# EAGLE schematic world_clock_2.0 (EAGLE 9.3.2)
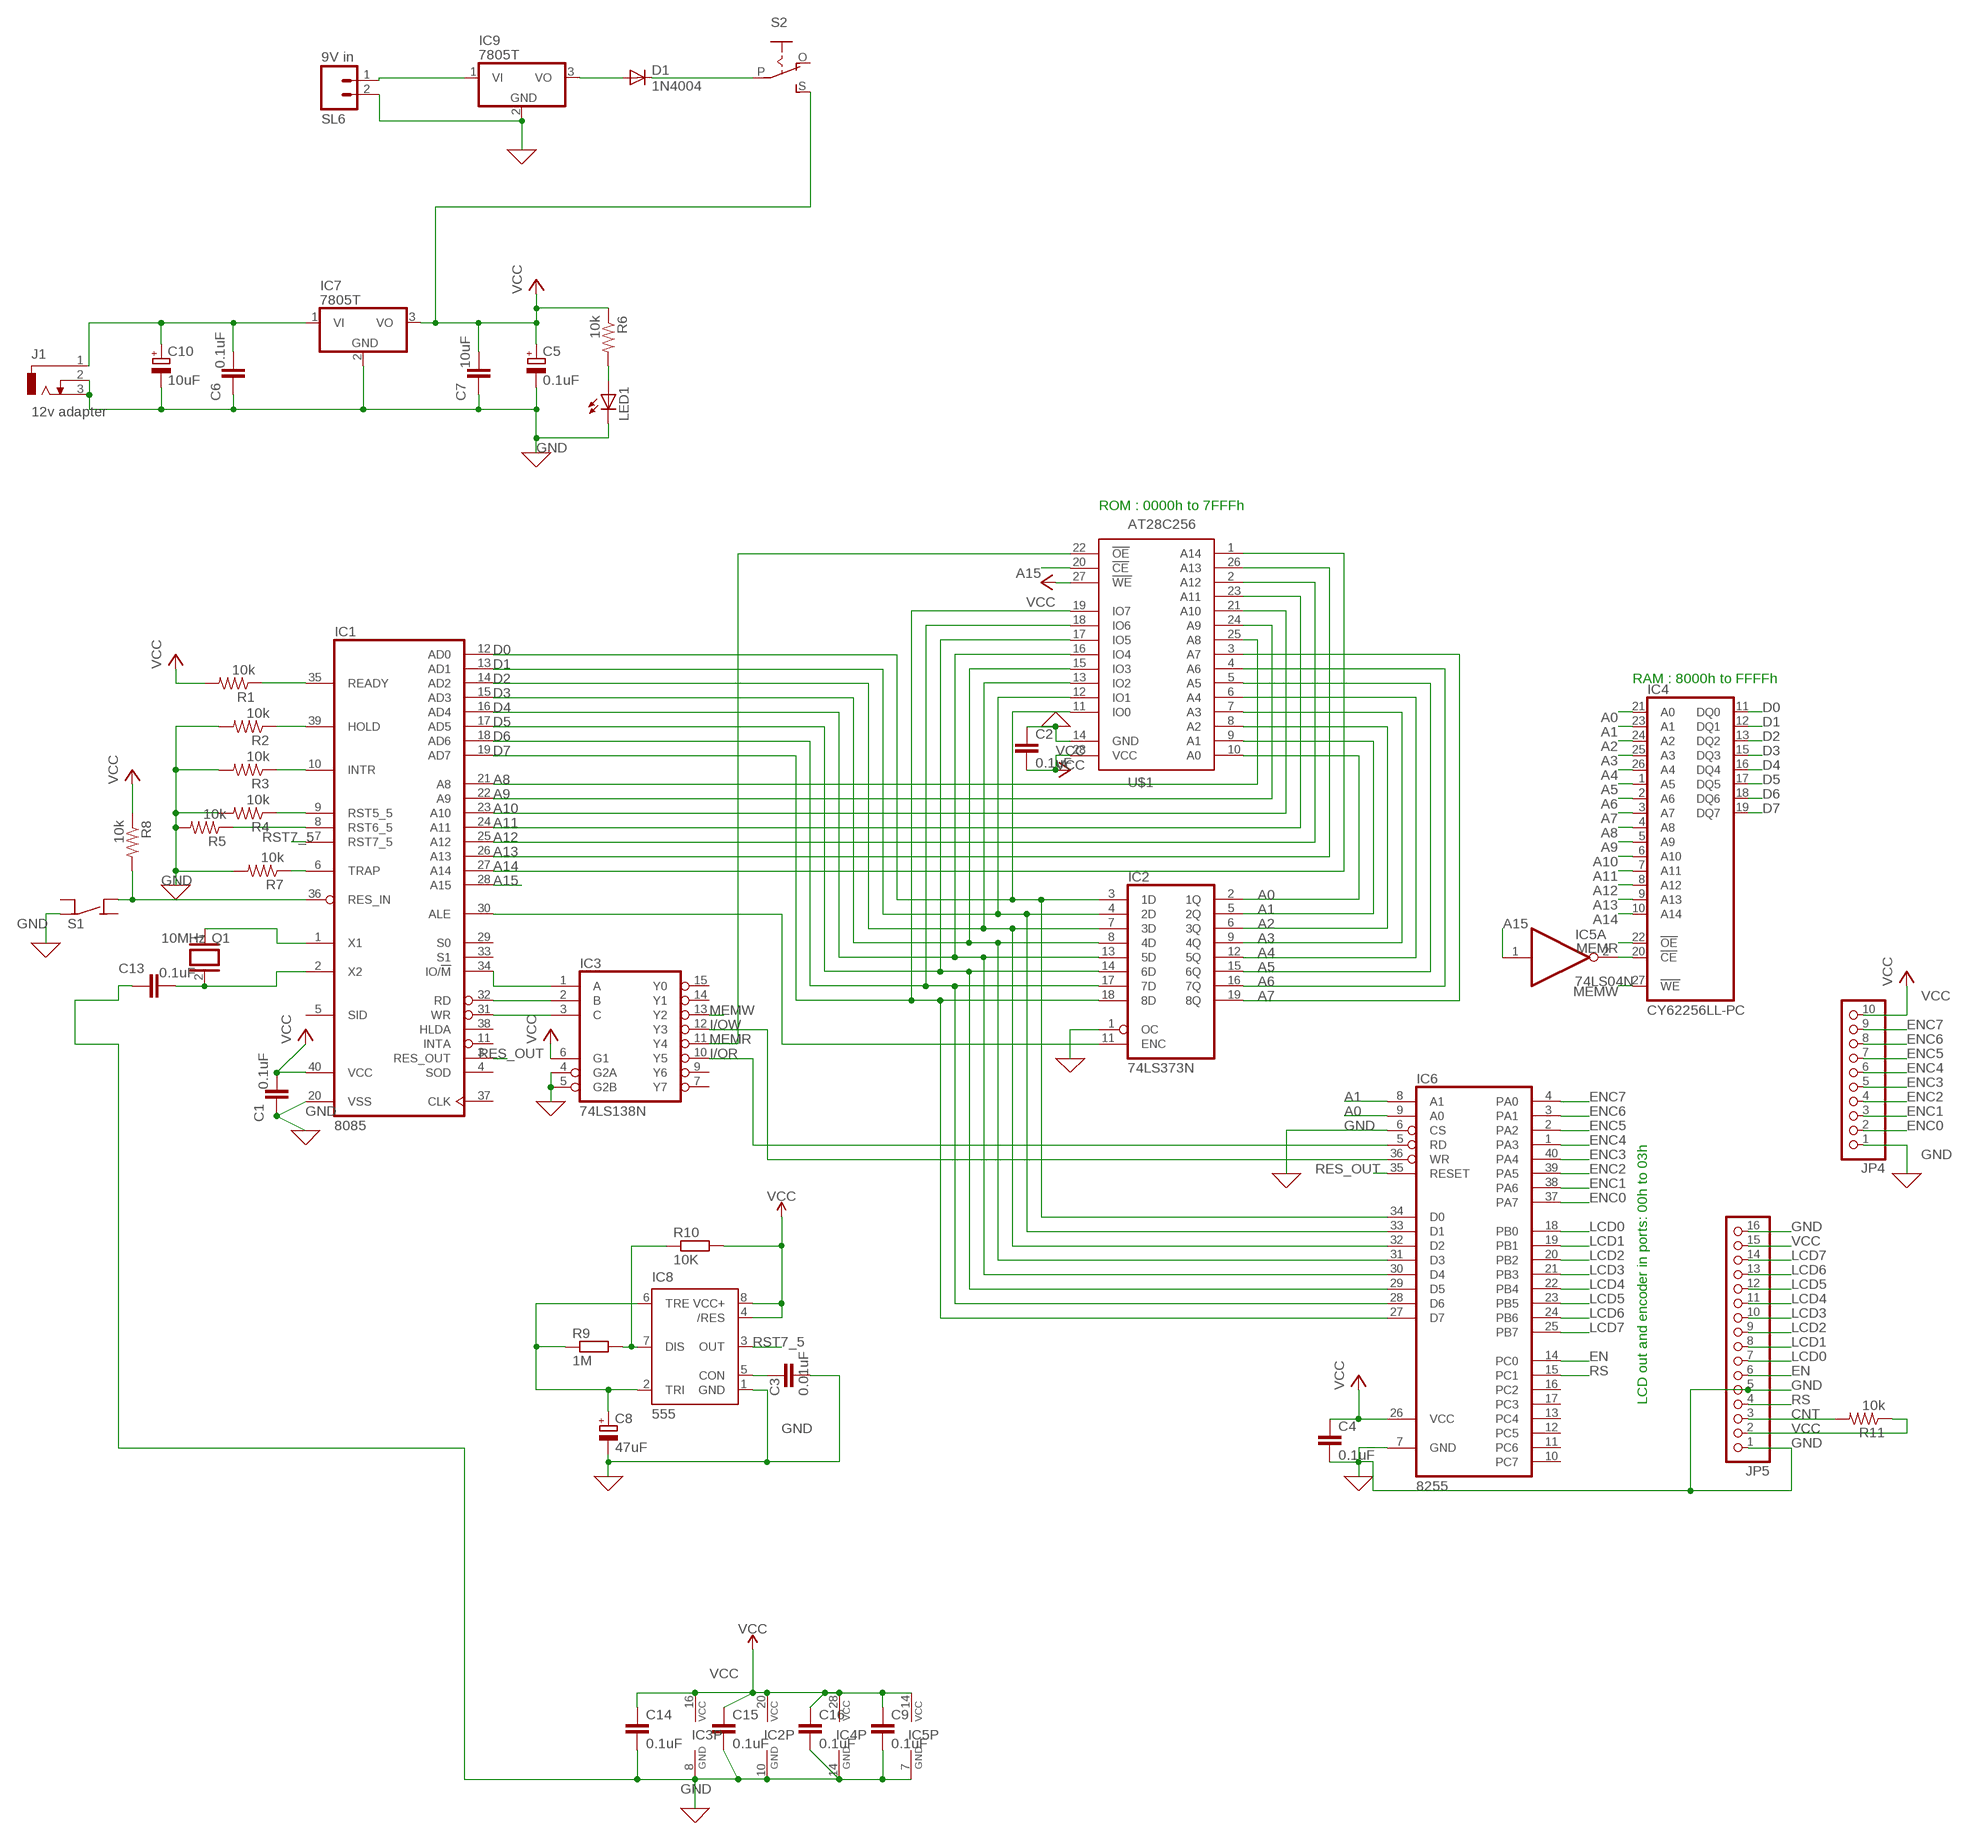
[diagram p0: schematic, sheet 1]

## Parts
C1  0.1uF  C-EU025-024X044  [C025-024X044]
C2  0.1uF  C-EU025-024X044  [C025-024X044]
C3  0.01uF  C2.5/2  [C2.5-2]
C4  0.1uF  C-EU025-024X044  [C025-024X044]
C5  0.1uF  CPOL-EUE5-8.5  [E5-8,5]
C6  0.1uF  C-EU025-024X044  [C025-024X044]
C7  10uF  C-EU025-024X044  [C025-024X044]
C8  47uF  CPOL-EUE5-8.5  [E5-8,5]
C9  0.1uF  C-EU025-024X044  [C025-024X044]
C10  10uF  CPOL-EUE5-8.5  [E5-8,5]
C13  0.1uF  C-EU025-024X044  [C025-024X044]
C14  0.1uF  C-EU025-024X044  [C025-024X044]
C15  0.1uF  C-EU025-024X044  [C025-024X044]
C16  0.1uF  C-EU025-024X044  [C025-024X044]
D1  1N4004  [DO41-10]
IC1  8085  [DIL40]
IC2  74LS373N  [DIL20]
IC3  74LS138N  [DIL16]
IC4  CY62256LL-PC  [DIL28-6]
IC5  74LS04N  [DIL14]
IC6  8255  82C55A  [DIL40]
IC7  7805T  [TO220H]
IC8  555  555KIT  [DIP08-KIT]
IC9  7805T  [TO220H]
J1  12v adapter  DCJ0303  [DCJ0303]
JP4  PINHD-1X10  [1X10]
JP5  PINHD-1X16  [1X16]
LED1  LED5MM  [LED5MM]
Q1  10MHz  XTAL/S  [QS]
R1  10k  R-US_0207/7  [0207/7]
R2  10k  R-US_0207/7  [0207/7]
R3  10k  R-US_0207/7  [0207/7]
R4  10k  R-US_0207/7  [0207/7]
R5  10k  R-US_0207/7  [0207/7]
R6  10k  R-US_0207/7  [0207/7]
R7  10k  R-US_0207/7  [0207/7]
R8  10k  R-US_0207/7  [0207/7]
R9  1M  R-EU_0204/5  [0204/5]
R10  10K  R-EU_0204/5  [0204/5]
R11  10k  R-US_0207/7  [0207/7]
S1  SPST4B3F-10XX  [B3F-10XX]
S2  EG1218S  [EG1218]
SL6  9V in  M02  [02P]
U$1  AT28C256  [DIL28-6]

## Nets
A0: IC2.2(1Q) IC4.21(A0) IC6.9(A0) U$1.10(A0)
A1: IC2.5(2Q) IC4.23(A1) IC6.8(A1) U$1.9(A1)
A2: IC2.6(3Q) IC4.24(A2) U$1.8(A2)
A3: IC2.9(4Q) IC4.25(A3) U$1.7(A3)
A4: IC2.12(5Q) IC4.26(A4) U$1.6(A4)
A5: IC2.15(6Q) IC4.1(A5) U$1.5(A5)
A6: IC2.16(7Q) IC4.2(A6) U$1.4(A6)
A7: IC2.19(8Q) IC4.3(A7) U$1.3(A7)
A8: IC1.21(A8) IC4.4(A8) U$1.25(A8)
A9: IC1.22(A9) IC4.5(A9) U$1.24(A9)
A10: IC1.23(A10) IC4.6(A10) U$1.21(A10)
A11: IC1.24(A11) IC4.7(A11) U$1.23(A11)
A12: IC1.25(A12) IC4.8(A12) U$1.2(A12)
A13: IC1.26(A13) IC4.9(A13) U$1.26(A13)
A14: IC1.27(A14) IC4.10(A14) U$1.1(A14)
A15: IC1.28(A15) IC5.1(A:I) U$1.20(!CE)
CNT: JP5.3 R11.2
D0: IC1.12(AD0) IC2.3(1D) IC4.11(DQ0) IC6.34(D0) U$1.11(IO0)
D1: IC1.13(AD1) IC2.4(2D) IC4.12(DQ1) IC6.33(D1) U$1.12(IO1)
D2: IC1.14(AD2) IC2.7(3D) IC4.13(DQ2) IC6.32(D2) U$1.13(IO2)
D3: IC1.15(AD3) IC2.8(4D) IC4.15(DQ3) IC6.31(D3) U$1.15(IO3)
D4: IC1.16(AD4) IC2.13(5D) IC4.16(DQ4) IC6.30(D4) U$1.16(IO4)
D5: IC1.17(AD5) IC2.14(6D) IC4.17(DQ5) IC6.29(D5) U$1.17(IO5)
D6: IC1.18(AD6) IC2.17(7D) IC4.18(DQ6) IC6.28(D6) U$1.18(IO6)
D7: IC1.19(AD7) IC2.18(8D) IC4.19(DQ7) IC6.27(D7) U$1.19(IO7)
EN: IC6.14(PC0) JP5.6
ENC0: IC6.37(PA7) JP4.2
ENC1: IC6.38(PA6) JP4.3
ENC2: IC6.39(PA5) JP4.4
ENC3: IC6.40(PA4) JP4.5
ENC4: IC6.1(PA3) JP4.6
ENC5: IC6.2(PA2) JP4.7
ENC6: IC6.3(PA1) JP4.8
ENC7: IC6.4(PA0) JP4.9
GND [GND]: C1.1 C2.1 C3.2 C4.2 C5.- C6.1 C7.1 C8.- C9.2 C10.- C13.1 C14.2 C15.2 C16.2 IC1.20(VSS) IC2.1(OC) IC2.10(GND) IC3.4(G2A) IC3.5(G2B) IC3.8(GND) IC4.14(GND) IC5.7(P:GND) IC6.6(CS) IC6.7(GND) IC7.2(GND) IC8.1(GND) IC9.2(GND) J1.2 J1.3 JP4.1 JP5.1 JP5.5 JP5.16 LED1.K(C) R2.2 R3.2 R4.2 R5.2 R7.2 S1.COM@1(COM) SL6.2 U$1.14(GND)
I/OR: IC3.10(Y5) IC6.5(RD)
I/OW: IC3.12(Y3) IC6.36(WR)
LCD0: IC6.18(PB0) JP5.7
LCD1: IC6.19(PB1) JP5.8
LCD2: IC6.20(PB2) JP5.9
LCD3: IC6.21(PB3) JP5.10
LCD4: IC6.22(PB4) JP5.11
LCD5: IC6.23(PB5) JP5.12
LCD6: IC6.24(PB6) JP5.13
LCD7: IC6.25(PB7) JP5.14
MEMR: IC3.11(Y4) IC4.22(!OE) U$1.22(!OE)
MEMW: IC3.13(Y2) IC4.27(!WE)
N$1: C8.+ IC8.2(TRI) IC8.6(TRE) R9.1
N$2 [VCC]: C6.2 C10.+ IC7.1(VI) J1.1
N$3: IC1.1(X1) Q1.1
N$4: C13.2 IC1.2(X2) Q1.2
N$5: IC1.35(READY) R1.1
N$6: IC1.39(HOLD) R2.1
N$7: IC8.7(DIS) R9.2 R10.1
N$8: IC1.10(INTR) R3.1
N$9: IC1.30(ALE) IC2.11(ENC)
N$10: IC1.9(RST5_5) R4.1
N$11: IC1.8(RST6_5) R5.1
N$12: C3.1 IC8.5(CON)
N$13: IC1.6(TRAP) R7.1
N$14 [VCC]: IC9.1(VI) SL6.1
N$15: IC1.36(RES_IN) R8.2 S1.NO@2(NO)
N$16 [VCC]: D1.A IC9.3(VO)
N$17 [VCC]: D1.C S2.P
N$18: LED1.A R6.2
N$19: IC4.20(!CE) IC5.2(A:O)
N$25: IC1.34(IO/!M) IC3.1(A)
N$26: IC1.32(RD) IC3.2(B)
N$27: IC1.31(WR) IC3.3(C)
RES_OUT: IC1.3(RES_OUT) IC6.35(RESET)
RS: IC6.15(PC1) JP5.4
RST7_5: IC1.7(RST7_5) IC8.3(OUT)
VCC [VCC]: C1.2 C2.2 C4.1 C5.+ C7.2 C9.1 C14.1 C15.1 C16.1 IC1.40(VCC) IC2.20(VCC) IC3.6(G1) IC3.16(VCC) IC4.28(VCC) IC5.14(P:VCC) IC6.26(VCC) IC7.3(VO) IC8.4(/RES) IC8.8(VCC+) JP4.10 JP5.2 JP5.15 R1.2 R6.1 R8.1 R10.2 R11.1 S2.S U$1.27(!WE) U$1.28(VCC)
Unconnected: IC1.4(SOD) IC1.5(SID) IC1.11(INTA) IC1.29(S0) IC1.33(S1) IC1.37(CLK) IC1.38(HLDA) IC3.7(Y7) IC3.9(Y6) IC3.14(Y1) IC3.15(Y0) IC5.3(B:I) IC5.4(B:O) IC5.5(C:I) IC5.6(C:O) IC5.8(D:O) IC5.9(D:I) IC5.10(E:O) IC5.11(E:I) IC5.12(F:O) IC5.13(F:I) IC6.10(PC7) IC6.11(PC6) IC6.12(PC5) IC6.13(PC4) IC6.16(PC2) IC6.17(PC3) S1.COM@2(COM) S1.NO@1(NO) S2.O

## Notes on the sheet
- ROM : 0000h to 7FFFh
- RAM : 8000h to FFFFh
- LCD out and encoder in ports: 00h to 03h

## Library data of the parts
C1 C2 C4 C6 C7 C9 C13-C16 = rcl:C-EU: CAPACITOR, European symbol; SPICEPREFIX: C
C3 = capacitor-wima:C: CAPACITOR naming: grid - package width
C5 C8 C10 = rcl:CPOL-EU: POLARIZED CAPACITOR, European symbol
D1 = adafruit:1N4004: DIODE General purpose 1N400x type rectifier (With bigger pads) http://www.ladyada.net/library/pcb/eaglelibrary.html
IC1 = micro-intel:8085: MICROCOMPUTER/PERIPHERAL DEVICE; OC_FARNELL: unknown; OC_NEWARK: unknown
IC2 = 74xx-eu:74*373: Octal D type transparent LATCH, edge triggered
IC3 = 74xx-eu:74*138: 3-line to 8-line DECODER/DEMULTIPLEXER
IC4 = memory-sram:CY62256LL-?*: 256K (32K x 8) CMOS-Static RAM Source: http://download.cypress.com.edgesuite.net/design_resources/datasheets/contents/cy62256_8.pdf
IC5 = 74xx-eu:74*04: Hex INVERTER
IC6 = micro-intel:82C55A: MICROCOMPUTER/PERIPHERAL DEVICE; MF: INTERSIL; MPN: IP82C55AZ; OC_FARNELL: 1562050; OC_NEWARK: 79K6939
IC7 IC9 = adafruit:78*: Positive VOLTAGE REGULATOR Added bigger pads to the TO-92 package
IC8 = SparkFun-IC-Special-Function:555: General purpose bipolar Timer Datasheet <http://www.sparkfun.com/datasheets/Components/General/ne555.pdf> SparkFun Products SparkFun SparkPunk Sequencer Kit <https://www.sparkfun.com/products/12707> (KIT-12707) Storefront Component: 555 Timer <https://www.sparkfun.com/products/9273> (COM-09273) Two parts valid for production: VFP: IC-11930 (M7555 PTH) VFP: IC-09173 (555 PTH) - Preferred; PROD_ID: IC-09173; PROD_ID_ALT: IC-11930
J1 = con-jack:DCJ0303: DC POWER JACK Source: DCJ0303.pdf; OC_FARNELL: unknown; OC_NEWARK: unknown
JP4 = pinhead:PINHD-1X10: PIN HEADER
JP5 = pinhead:PINHD-1X16: PIN HEADER
LED1 = adafruit:LED: LED OSRAM: - CHIPLED LG R971, LG N971, LY N971, LG Q971, LY Q971, LO R971, LY R971 LH N974, LH R974 LS Q976, LO Q976, LY Q976 LO Q996 - Hyper CHIPLED LW Q18S LB Q993, LB Q99A, LB R99A - SideLED LS A670, LO A670, LY A670, LG A670, LP A670 LB A673, LV A673, LT A673, LW A673 LH A674 LY A675 LS A676, LA A676, LO A676, LY A676, LW A676 LS A679, LY A679, LG A679 - Hyper Micro SIDELED® LS Y876, LA Y876, LO Y876, LY Y876 LT Y87S - SmartLED LW L88C, LW L88S LB L89C, LB L89S, LG L890 LS L89K, LO L89K, LY L89K LS L896, LA L896, LO L896, LY L896 - TOPLED LS T670, LO T670, LY T670, LG T670, LP T670 LSG T670, LSP T670, LSY T670, LOP T670, LYG T670 LG T671, LOG T671, LSG T671 LB T673, LV T673, LT T673, LW T673 LH T674 LS T676, LA T676, LO T676, LY T676, LB T676, LH T676, LSB T676, LW T676 LB T67C, LV T67C, LT T67C, LS T67K, LO T67K, LY T67K, LW E67C LS E67B, LA E67B, LO E67B, LY E67B, LB E67C, LV E67C, LT E67C LW T67C LS T679, LY T679, LG T679 LS T770, LO T770, LY T770, LG T770, LP T770 LB T773, LV T773, LT T773, LW T773 LH T774 LS E675, LA E675, LY E675, LS T675 LS T776, LA T776, LO T776, LY T776, LB T776 LHGB T686 LT T68C, LB T68C - Hyper Mini TOPLED® LB M676 - Mini TOPLED Santana® LG M470 LS M47K, LO M47K, LY M47K Source: http://www.osram.convergy.de/
Q1 = special:XTAL/S: CRYSTAL
R1-R8 R11 = rcl:R-US_: RESISTOR, American symbol
R9 R10 = rcl:R-EU_: RESISTOR, European symbol; SPICEPREFIX: R
S1 = bt_electromech:SPST4: SPST switch with 2 pins per contact
S2 = adafruit:EG1218: SLIDING SWITCH 0.1" spacing through hole, vertical SPDT slide switch http://www.ladyada.net/library/pcb/eaglelibrary.html
SL6 = CEDT_JANUARY_2015_v5:M02: AMP QUICK CONNECTOR
U$1 = bt_memory:AT28C256: EEPROM 32Kx8 256k bit The AT28C256 is a high-performance Electrically Erasable and Programmable Read Only Memory. Its 256K of memory is organized as 32,768 words by 8 bits.

## Net classes
0 default: width 0.406 mm, drill 0.254 mm, clearance 0.406 mm
1 VCC: width 0.61 mm, drill 0.254 mm, clearance 0.254 mm to class 0, clearance 0.406 mm
2 GND: width 0.61 mm, drill 0.254 mm, clearance 0.254 mm to class 0, clearance 0.406 mm to class 1, clearance 0.406 mm